# Altium schematic sheet antenna-bottomside.SchDoc
size A
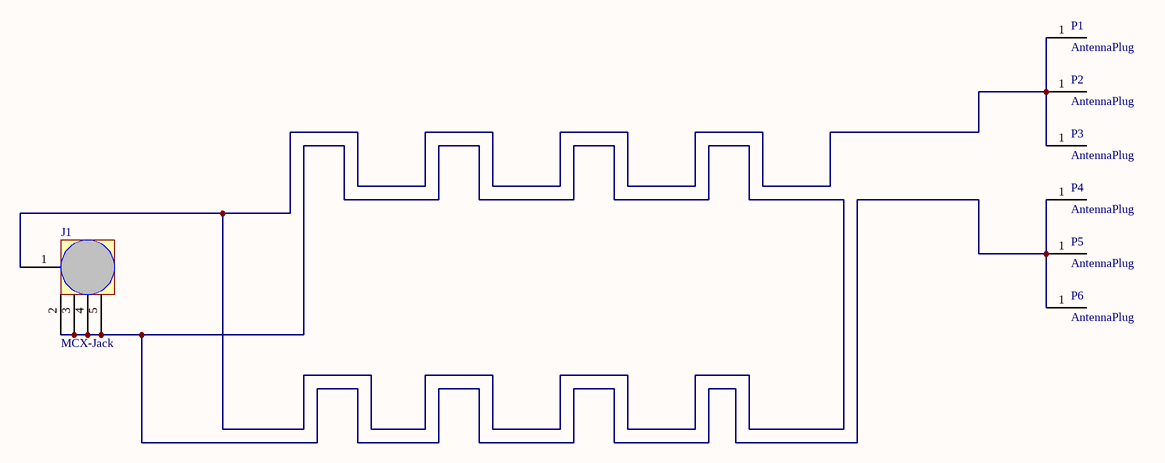
[diagram p0: antenna-bottomside.SchDoc]

## Parts
J1  MCX-Jack  [MCX-Jack]
P1  AntennaPlug  [Keystone_PN8737]
P2  AntennaPlug  [Keystone_PN8737]
P3  AntennaPlug  [Keystone_PN8737]
P4  AntennaPlug  [Keystone_PN8737]
P5  AntennaPlug  [Keystone_PN8737]
P6  AntennaPlug  [Keystone_PN8737]

## Nets
NetJ1_1: J1.1 J1.2 J1.3 J1.4 J1.5

Not connected (* = marked no-connect by the designer): P1 1; P2 1; P3 1; P4 1; P5 1; P6 1